# EAGLE schematic stepper-motor-driver (EAGLE 5.01)
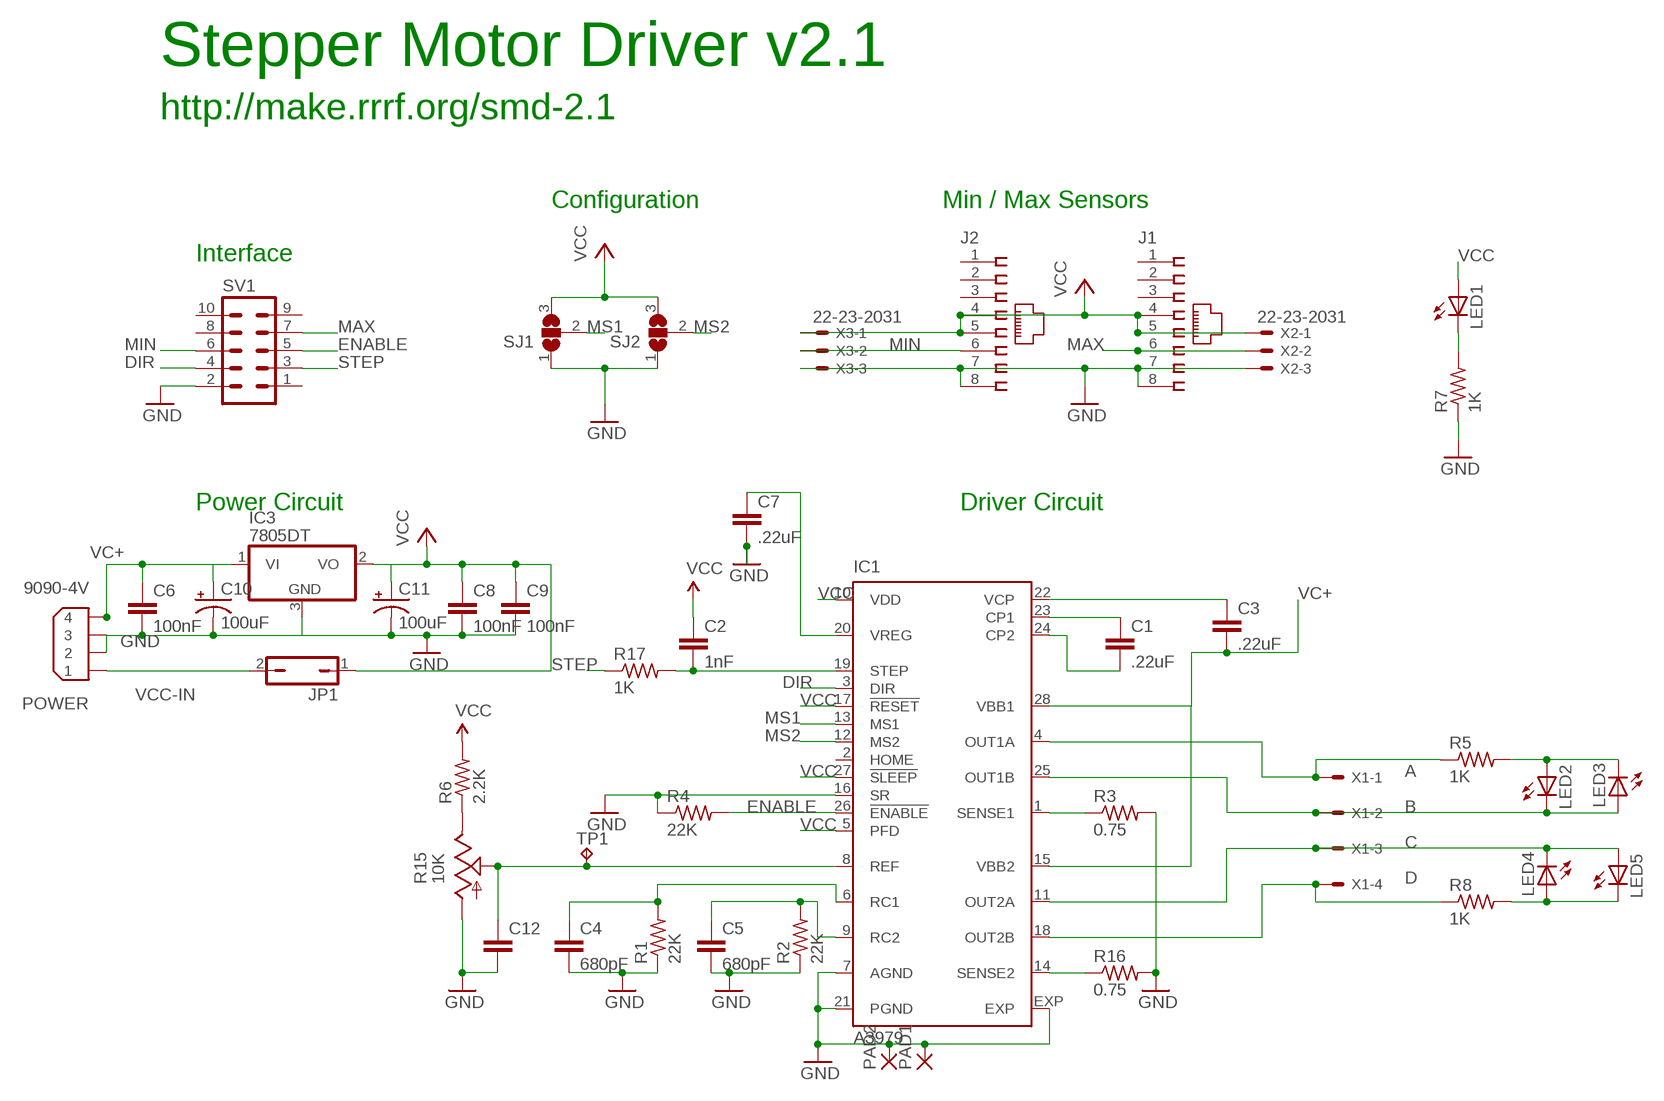
[diagram p0: schematic, sheet 1]

## Parts
C1  .22uF  C-EUC1206K  [C1206K]
C2  1nF  C-EUC1206K  [C1206K]
C3  .22uF  C-EUC1206K  [C1206K]
C4  680pF  C-EUC1206K  [C1206K]
C5  680pF  C-EUC1206K  [C1206K]
C6  100nF  C-EUC1206K  [C1206K]
C7  .22uF  C-EUC1206K  [C1206K]
C8  100nF  C-EUC1206K  [C1206K]
C9  100nF  C-EUC1206K  [C1206K]
C10  100uF  CPOL-USUD-8X10  [UD-8X10_NICHICON]
C11  100uF  CPOL-USUD-8X10  [UD-8X10_NICHICON]
C12  C-EUC1206  [C1206]
IC1  A3979  [TSSOP28]
IC3  7805DT  [TO252]
J1  520426-4  [520426-4]
J2  520426-4  [520426-4]
JP1  JP1Q  [JP1]
LED1  LEDCHIPLED_1206  [CHIPLED_1206]
LED2  LEDCHIPLED_1206  [CHIPLED_1206]
LED3  LEDCHIPLED_1206  [CHIPLED_1206]
LED4  LEDCHIPLED_1206  [CHIPLED_1206]
LED5  LEDCHIPLED_1206  [CHIPLED_1206]
PAD1  1,6/0,8  [1,6/0,8]
PAD2  1,6/0,8  [1,6/0,8]
POWER  9090-4V  [9090-4V]
R1  22K  R-US_R1206  [R1206]
R2  22K  R-US_R1206  [R1206]
R3  0.75  R-US_R2512  [R2512]
R4  22K  R-US_R1206  [R1206]
R5  1K  R-US_R1206  [R1206]
R6  2.2K  R-US_R1206  [R1206]
R7  1K  R-US_R1206  [R1206]
R8  1K  R-US_R1206  [R1206]
R15  10K  TRIM_US-B25P  [B25P]
R16  0.75  R-US_R2512  [R2512]
R17  1K  R-US_R1206  [R1206]
SJ1  SJ2W  [SJ_2]
SJ2  SJ2W  [SJ_2]
SV1  ML10  [ML10]
TP1  TPPAD1-13  [P1-13]
X1  KK-156-4  [KK-156-4]
X2  22-23-2031  [22-23-2031]
X3  22-23-2031  [22-23-2031]

## Nets
A [Power]: IC1.4(OUT1A) R5.1 X1.1
B [Power]: IC1.25(OUT1B) LED2.C LED3.A X1.2
C [Power]: IC1.11(OUT2A) LED4.C LED5.A X1.3
D [Power]: IC1.18(OUT2B) R8.1 X1.4
DIR: IC1.3(DIR) SV1.4
ENABLE: IC1.26(!ENABLE) R4.2 SV1.5
GND [Power]: C4.2 C5.2 C6.2 C7.2 C8.2 C9.2 C10.- C11.- C12.2 IC1.7(AGND) IC1.16(SR) IC1.21(PGND) IC1.EXP IC3.3(GND) J1.7 J1.8 J2.7 J2.8 PAD1.1(P) PAD2.1(P) POWER.2 POWER.3 R1.1 R2.1 R3.2 R4.1 R7.1 R15.A R16.2 SJ1.1 SJ2.1 SV1.2 X2.3 X3.3
MAX: J1.6 SV1.7 X2.2
MIN: J2.6 SV1.6 X3.2
MS1: IC1.13(MS1) SJ1.2
MS2: IC1.12(MS2) SJ2.2
N$1: C7.1 IC1.20(VREG)
N$2 [Power]: IC1.14(SENSE2) R16.1
N$3 [Power]: IC1.1(SENSE1) R3.1
N$4 [Power]: C3.1 IC1.22(VCP)
N$5: C1.1 IC1.23(CP1)
N$6: C1.2 IC1.24(CP2)
N$7: C4.1 IC1.6(RC1) R1.2
N$8: LED1.C R7.2
N$9: R6.1 R15.E
N$10: LED2.A LED3.C R5.2
N$11: C5.1 IC1.9(RC2) R2.2
N$12 [Power]: LED4.A LED5.C R8.2
N$13: C12.1 IC1.8(REF) R15.S TP1.1(TP)
N$14: C2.2 IC1.19(STEP) R17.2
STEP: R17.1 SV1.3
VC+ [Power]: C3.2 C6.1 C10.+ IC1.15(VBB2) IC1.28(VBB1) IC3.1(VI) POWER.4
VCC: C2.1 C8.1 C9.1 C11.+ IC1.5(PFD) IC1.10(VDD) IC1.17(!RESET) IC1.27(!SLEEP) IC3.2(VO) J1.4 J1.5 J2.4 J2.5 JP1.1 LED1.A R6.2 SJ1.3 SJ2.3 X2.1 X3.1
VCC-IN: JP1.2 POWER.1
Unconnected: IC1.2(HOME) J1.1 J1.2 J1.3 J2.1 J2.2 J2.3 SV1.1 SV1.8 SV1.9 SV1.10

## Notes on the sheet
- Stepper Motor Driver v2.1
- http://make.rrrf.org/smd-2.1
- Configuration | Min / Max Sensors
- Interface
- Power Circuit | Driver Circuit

## Library data of the parts
C1-C9 = rcl:C-EU: CAPACITOR, European symbol
C10 C11 = rcl:CPOL-US: POLARIZED CAPACITOR, American symbol
C12 = resistor:C-EU: CAPACITOR, European symbol
IC1 = linear:A3979: Microstepping DMOS Driver with Translator Source: http://allegromicro.com/datafile/3979.pdf
IC3 = linear:78*: Positive VOLTAGE REGULATOR Source: http://cache.national.com/ds/LM/LM78L05.pdf http://www.fairchildsemi.com/ds/LM/LM7805.pdf
J1 J2 = con-amp:520426-4: AMP connector
JP1 = jumper:JP1Q: JUMPER
LED1-LED5 = led:LED: LED OSRAM: - CHIPLED LG R971, LG N971, LY N971, LG Q971, LY Q971, LO R971, LY R971 LH N974, LH R974 LS Q976, LO Q976, LY Q976 LO Q996 - Hyper CHIPLED LW Q18S LB Q993, LB Q99A, LB R99A - SideLED LS A670, LO A670, LY A670, LG A670, LP A670 LB A673, LV A673, LT A673, LW A673 LH A674 LY A675 LS A676, LA A676, LO A676, LY A676, LW A676 LS A679, LY A679, LG A679 - Hyper Micro SIDELED® LS Y876, LA Y876, LO Y876, LY Y876 LT Y87S - SmartLED LW L88C, LW L88S LB L89C, LB L89S, LG L890 LS L89K, LO L89K, LY L89K LS L896, LA L896, LO L896, LY L896 - TOPLED LS T670, LO T670, LY T670, LG T670, LP T670 LSG T670, LSP T670, LSY T670, LOP T670, LYG T670 LG T671, LOG T671, LSG T671 LB T673, LV T673, LT T673, LW T673 LH T674 LS T676, LA T676, LO T676, LY T676, LB T676, LH T676, LSB T676, LW T676 LB T67C, LV T67C, LT T67C, LS T67K, LO T67K, LY T67K, LW E67C LS E67B, LA E67B, LO E67B, LY E67B, LB E67C, LV E67C, LT E67C LW T67C LS T679, LY T679, LG T679 LS T770, LO T770, LY T770, LG T770, LP T770 LB T773, LV T773, LT T773, LW T773 LH T774 LS E675, LA E675, LY E675, LS T675 LS T776, LA T776, LO T776, LY T776, LB T776 LHGB T686 LT T68C, LB T68C - Hyper Mini TOPLED® LB M676 - Mini TOPLED Santana® LG M470 LS M47K, LO M47K, LY M47K Source: http://www.osram.convergy.de - LUMILED® LXK2-PW12-R00, LXK2-PW12-S00, LXK2-PW14-U00, LXK2-PW14-V00 LXK2-PM12-R00, LXK2-PM12-S00, LXK2-PM14-U00 LXK2-PE12-Q00, LXK2-PE12-R00, LXK2-PE12-S00, LXK2-PE14-T00, LXK2-PE14-U00 LXK2-PB12-K00, LXK2-PB12-L00, LXK2-PB12-M00, LXK2-PB14-N00, LXK2-PB14-P00, LXK2-PB14-Q00 LXK2-PR12-L00, LXK2-PR12-M00, LXK2-PR14-Q00, LXK2-PR14-R00 LXK2-PD12-Q00, LXK2-PD12-R00, LXK2-PD12-S00 LXK2-PH12-R00, LXK2-PH12-S00 LXK2-PL12-P00, LXK2-PL12-Q00, LXK2-PL12-R00 Source: www.luxeon.com
PAD1 PAD2 = wirepad:1,6/0,8: THROUGH-HOLE PAD
POWER = con-thomas-betts:9090-4: Disk Drive Power four position Source: Thomas & Betts Electronic Interconnects Eiropean Edition 1998
R1 R2 R5 = resistor:R-US_: RESISTOR, American symbol
R3 R4 R6-R8 R16 R17 = rcl:R-US_: RESISTOR, American symbol
R15 = pot:TRIM_US-: POTENTIOMETER
SJ1 SJ2 = jumper:SJ2W: SMD solder JUMPER
SV1 = con-harting-ml:ML10: HARTING
TP1 = testpad:TP: Test pad
X1 = con-molex:KK-156-4: KK 156 HEADER Source: http://www.molex.com/pdm_docs/sd/026604100_sd.pdf
X2 X3 = con-molex:22-23-2031: .100" (2.54mm) Center Header - 3 Pin

## Net classes
0 default: width 0.406 mm
1 Power: width 0.406 mm, clearance 0.406 mm